# Altium schematic sheet Sheet3.SchDoc
size 420 x 297 mm
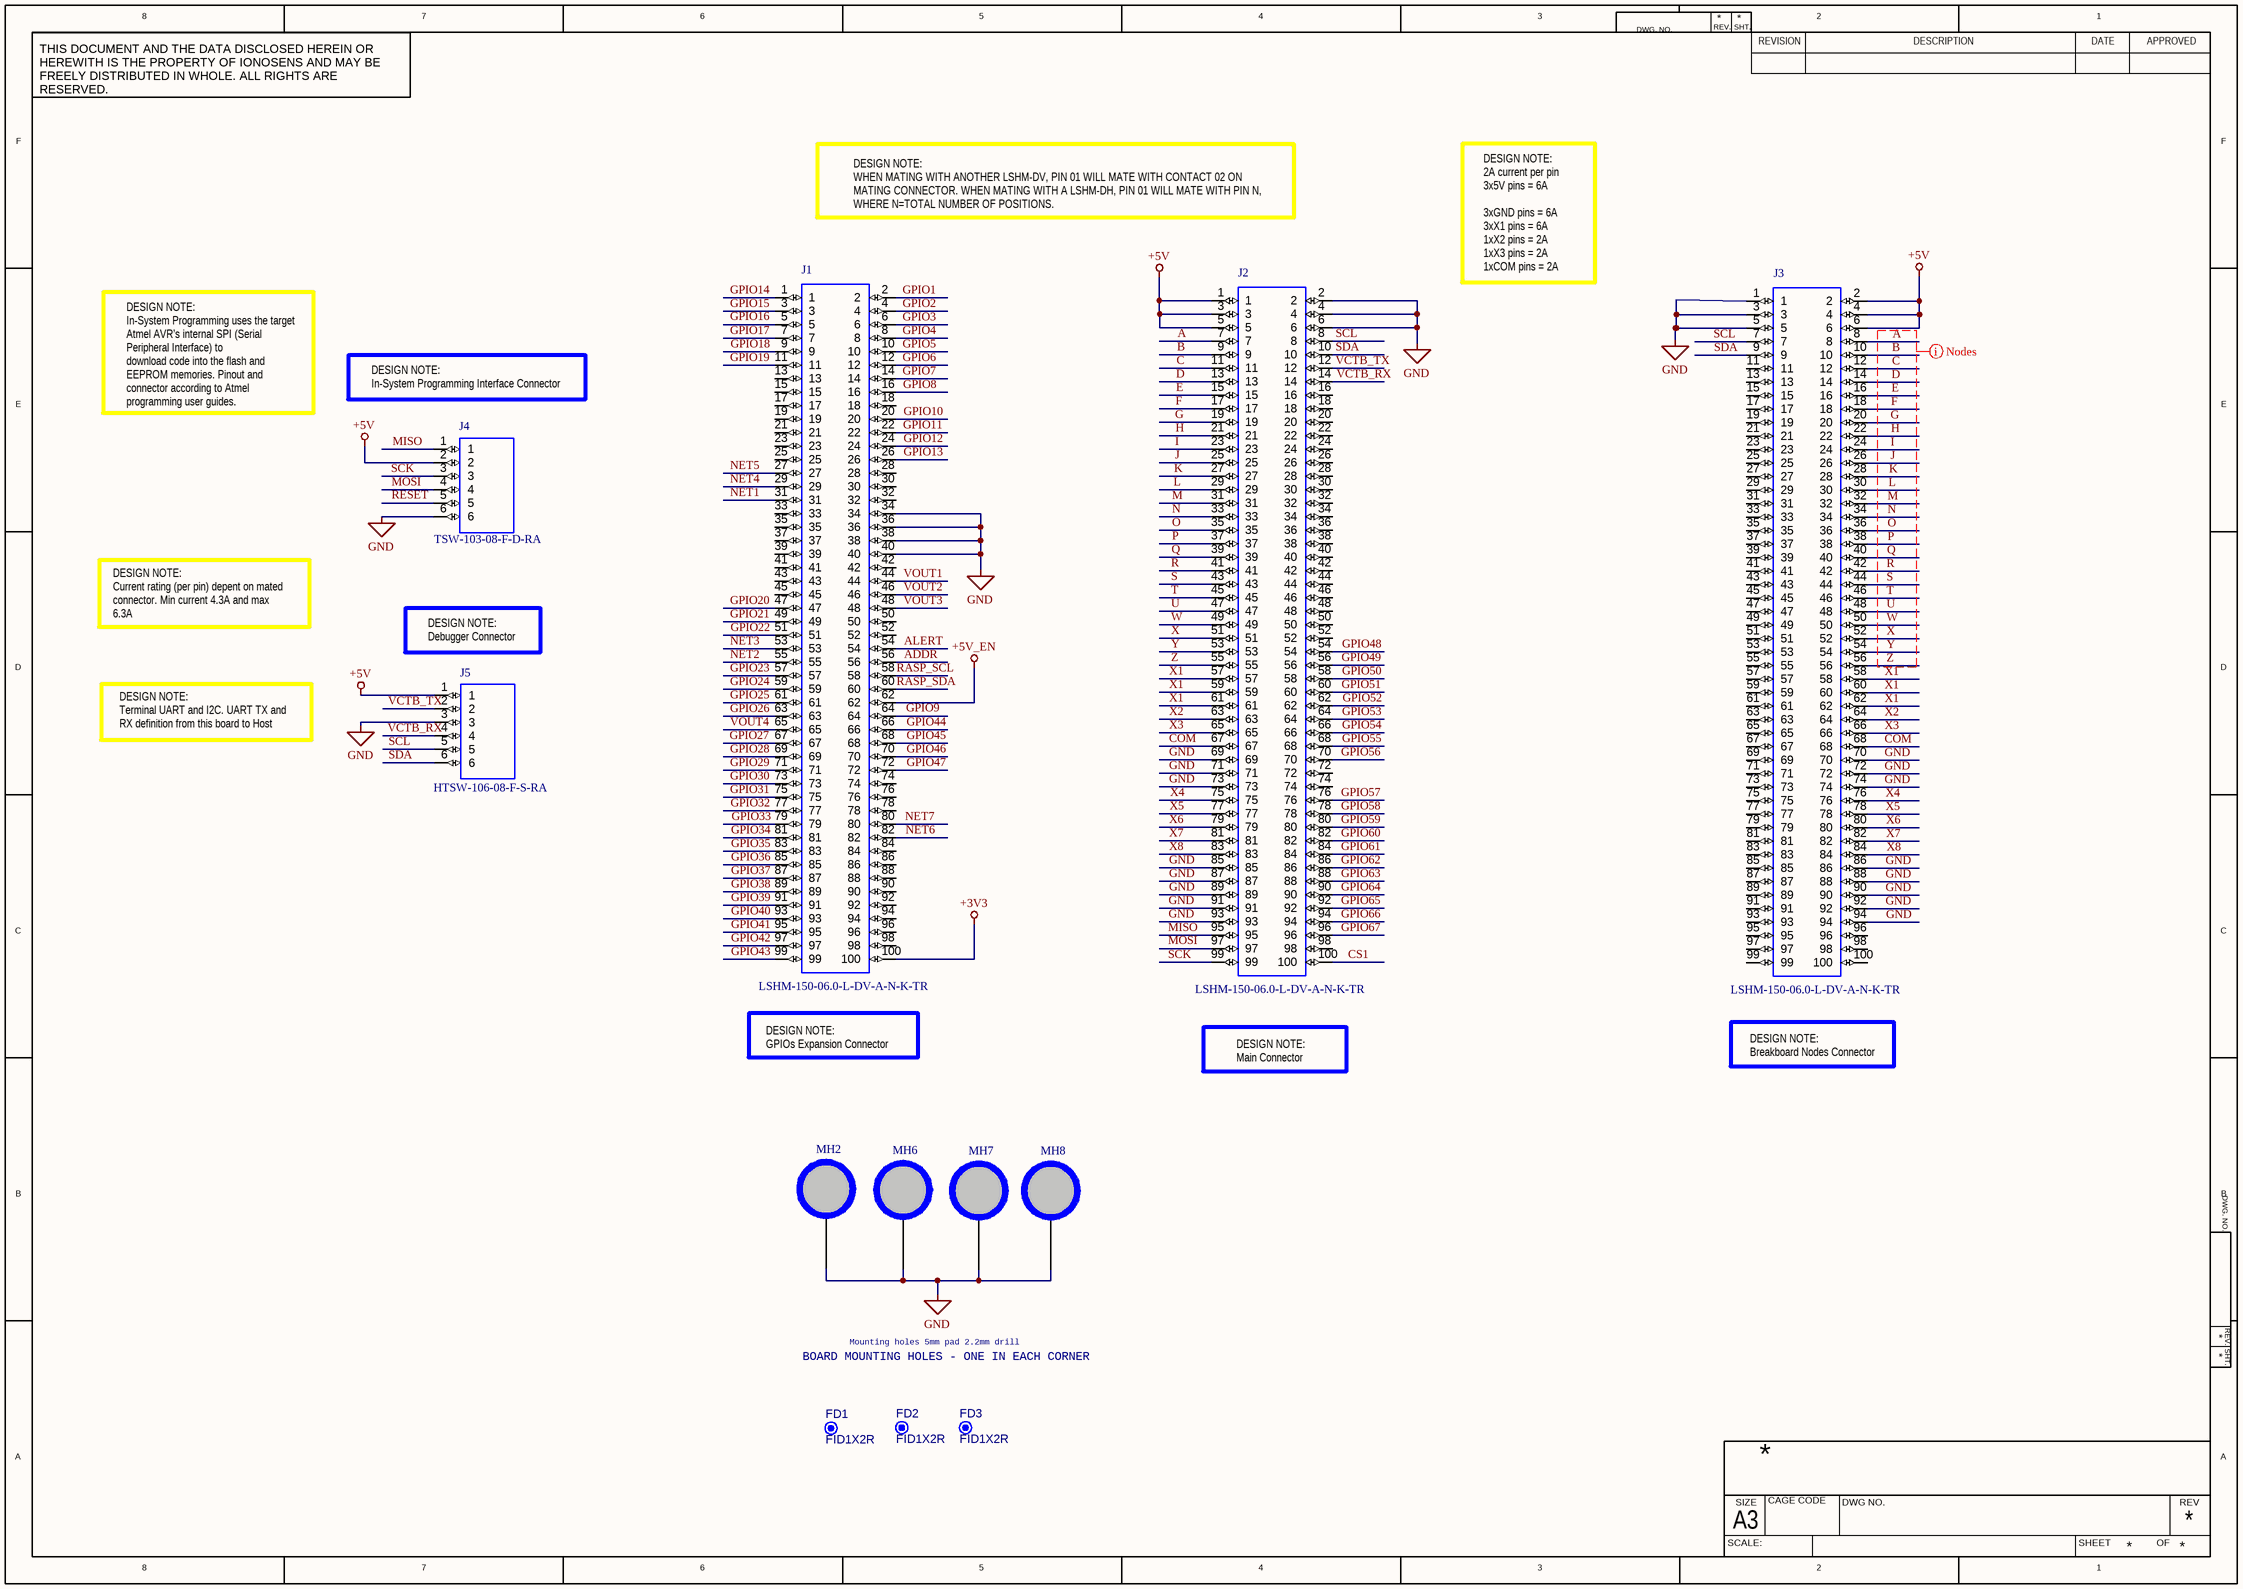
[diagram p0: Sheet3.SchDoc]

## Parts
FD1  FID1X2R  [FID1X2R]  (no BOM)
FD2  FID1X2R  [FID1X2R]  (no BOM)
FD3  FID1X2R  [FID1X2R]  (no BOM)
J1  LSHM-150-06.0-L-DV-A-N-K-TR  [LSHM_150_06_0_L_DV_A_N_K_TR]
J2  LSHM-150-06.0-L-DV-A-N-K-TR  [LSHM_150_06_0_L_DV_A_N_K_TR]
J3  LSHM-150-06.0-L-DV-A-N-K-TR  [LSHM_150_06_0_L_DV_A_N_K_TR]
J4  TSW-103-08-F-D-RA  [TSW-103-08-F-D-RA]
J5  HTSW-106-08-F-S-RA  [TSW-106-08-F-S-RA]
MH2  C500h220  [C500h220z368]  (value not drawn)
MH6  C500h220  [C500h220z368]  (value not drawn)
MH7  C500h220  [C500h220z368]  (value not drawn)
MH8  C500h220  [C500h220z368]  (value not drawn)

## Nets
+3V3: J1.100
+5V: J2.1 J2.3 J2.5 J3.2 J3.4 J3.6 J4.2 J5.1
+5V_EN: J1.62
GND: J1.34 J1.36 J1.38 J1.40 J2.2 J2.4 J2.6 J2.69 J2.71 J2.73 J2.85 J2.87 J2.89 J2.91 J2.93 J3.1 J3.3 J3.5 J3.70 J3.72 J3.74 J3.86 J3.88 J3.90 J3.92 J3.94 J4.6 J5.3 MH2.1 MH6.1 MH7.1 MH8.1
A: J2.7 J3.8
ADDR: J1.56
ALERT: J1.54
B: J2.9 J3.10
C: J2.11 J3.12
COM: J2.67 J3.68
CS1: J2.100
D: J2.13 J3.14
E: J2.15 J3.16
F: J2.17 J3.18
G: J2.19 J3.20
GPIO1: J1.2
GPIO2: J1.4
GPIO3: J1.6
GPIO4: J1.8
GPIO5: J1.10
GPIO6: J1.12
GPIO7: J1.14
GPIO8: J1.16
GPIO9: J1.64
GPIO10: J1.20
GPIO11: J1.22
GPIO12: J1.24
GPIO13: J1.26
GPIO14: J1.1
GPIO15: J1.3
GPIO16: J1.5
GPIO17: J1.7
GPIO18: J1.9
GPIO19: J1.11
GPIO20: J1.47
GPIO21: J1.49
GPIO22: J1.51
GPIO23: J1.57
GPIO24: J1.59
GPIO25: J1.61
GPIO26: J1.63
GPIO27: J1.67
GPIO28: J1.69
GPIO29: J1.71
GPIO30: J1.73
GPIO31: J1.75
GPIO32: J1.77
GPIO33: J1.79
GPIO34: J1.81
GPIO35: J1.83
GPIO36: J1.85
GPIO37: J1.87
GPIO38: J1.89
GPIO39: J1.91
GPIO40: J1.93
GPIO41: J1.95
GPIO42: J1.97
GPIO43: J1.99
GPIO44: J1.66
GPIO45: J1.68
GPIO46: J1.70
GPIO47: J1.72
GPIO48: J2.54
GPIO49: J2.56
GPIO50: J2.58
GPIO51: J2.60
GPIO52: J2.62
GPIO53: J2.64
GPIO54: J2.66
GPIO55: J2.68
GPIO56: J2.70
GPIO57: J2.76
GPIO58: J2.78
GPIO59: J2.80
GPIO60: J2.82
GPIO61: J2.84
GPIO62: J2.86
GPIO63: J2.88
GPIO64: J2.90
GPIO65: J2.92
GPIO66: J2.94
GPIO67: J2.96
H: J2.21 J3.22
I: J2.23 J3.24
J: J2.25 J3.26
K: J2.27 J3.28
L: J2.29 J3.30
M: J2.31 J3.32
MISO: J2.95 J4.1
MOSI: J2.97 J4.4
N: J2.33 J3.34
NET1: J1.31
NET2: J1.55
NET3: J1.53
NET4: J1.29
NET5: J1.27
NET6: J1.82
NET7: J1.80
O: J2.35 J3.36
P: J2.37 J3.38
Q: J2.39 J3.40
R: J2.41 J3.42
RASP_SCL: J1.58
RASP_SDA: J1.60
RESET: J4.5
S: J2.43 J3.44
SCK: J2.99 J4.3
SCL: J2.8 J3.7 J5.5
SDA: J2.10 J3.9 J5.6
T: J2.45 J3.46
U: J2.47 J3.48
VCTB_RX: J2.14 J5.4
VCTB_TX: J2.12 J5.2
VOUT1: J1.44
VOUT2: J1.46
VOUT3: J1.48
VOUT4: J1.65
W: J2.49 J3.50
X: J2.51 J3.52
X1: J2.57 J2.59 J2.61 J3.58 J3.60 J3.62
X2: J2.63 J3.64
X3: J2.65 J3.66
X4: J2.75 J3.76
X5: J2.77 J3.78
X6: J2.79 J3.80
X7: J2.81 J3.82
X8: J2.83 J3.84
Y: J2.53 J3.54
Z: J2.55 J3.56

Not connected (* = marked no-connect by the designer): J1 13 15 17 18 19 21 23 25 28 30 32 33 35 37 39 41 42 43 45 50 52 74 76 78 84 86 88 90 92 94 96 98; J2 16 18 20 22 24 26 28 30 32 34 36 38 40 42 44 46 48 50 52 72 74 98; J3 11 13 15 17 19 21 23 25 27 29 31 33 35 37 39 41 43 45 47 49 51 53 55 57 59 61 63 65 67 69 71 73 75 77 79 81 83 85 87 89 91 93 95 96 97 98 99 100

## Layout directives
net class Nodes: A, B, C, D, E, F, G, H, I, J, K, L, M, N, O, P, Q, R, S, T, U, W, X, Y, Z

## Notes on the sheet
- DESIGN NOTE:
  WHEN MATING WITH ANOTHER LSHM-DV, PIN 01 WILL MATE WITH CONTACT 02 ON
  MATING CONNECTOR. WHEN MATING WITH A LSHM-DH, PIN 01 WILL MATE WITH PIN N,
  WHERE N=TOTAL NUMBER OF POSITIONS.
- DESIGN NOTE:
  2A current per pin
  3x5V pins = 6A
  3xGND pins = 6A
  3xX1 pins = 6A
  1xX2 pins = 2A
  1xX3 pins = 2A
  1xCOM pins = 2A
- DESIGN NOTE:
  In-System Programming Interface Connector
- DESIGN NOTE:
  In-System Programming uses the target Atmel AVR’s internal SPI (Serial Peripheral Interface) to
  download code into the flash and EEPROM memories. Pinout and connector according to Atmel programming user guides.
- DESIGN NOTE:
  Current rating (per pin) depent on mated connector. Min current 4.3A and max 6.3A
- (near J5) DESIGN NOTE:
  Debugger Connector
- DESIGN NOTE:
  Terminal UART and I2C. UART TX and RX definition from this board to Host
- DESIGN NOTE:
  GPIOs Expansion Connector
- DESIGN NOTE:
  Main Connector
- DESIGN NOTE:
  Breakboard Nodes Connector
- BOARD MOUNTING HOLES - ONE IN EACH CORNER
- Mounting holes 5mm pad 2.2mm drill
- 8
- 7
- 6
- 5
- 4
- 3
- DWG. NO.
- REV.
- SHT.
- REVISION
- 2
- DESCRIPTION
- DATE
- 1
- APPROVED
- THIS DOCUMENT AND THE DATA DISCLOSED HEREIN OR HEREWITH IS THE PROPERTY OF IONOSENS AND MAY BE FREELY DISTRIBUTED IN WHOLE. ALL RIGHTS ARE RESERVED.
- F
- E
- D
- C
- B
- A
- SCALE:
- A3
- SIZE
- CAGE CODE
- DWG NO.
- SHEET
- OF
- REV

## Library data of the parts
FD1-FD3 = CMP-00028-00005-2: Fiducial - Round 1x2mm; Pins: 0
J1-J3 = J01-001-01-00001-2: Conn Socket and Terminal Strip HDR/SKT 100 POS 0.5mm Solder ST SMD T/R; Manufacturer: Samtec; Gender: HERMAPHRODITIC; Pitch: 500 µm; Contact Plating: Gold; Case/Package: SMD; Max Operating Temperature: 125°C; Number of Rows: 2; RoHS Compliant: Yes; Housing Color: Black; Mounting Technology: SMD; Pins: 100; Termination: Solder; Orientation: Straight; Depth: 4.98 mm; Length: 29.7 mm; Contact Material: Bronze; Housing Material: Polymer; Min Operating Temperature: -55°C; Manufacturer P/N: LSHM-150-06.0-L-DV-A-N-K-TR
J4 = J01-001-01-00003-2: 6 Vias Pin Header 2.54mm, Right Angle; Manufacturer: Samtec; Gender: Male; RoHS Compliant: Yes; Min Operating Temperature: -55°C; Case/Package: Through Hole; Termination: Solder; Depth: 4.87 mm; Max Operating Temperature: 125°C; Housing Material: Polyester; Mounting Technology: Through Hole; Number of Rows: 2; Pitch: 2.54mm; Contact Plating: Gold; Contact Material: Bronze; Manufacturer P/N: TSW-103-08-F-D-RA; Pins: 6; Orientation: Straight; Length: 7.62 mm; Housing Color: Black
J5 = J01-001-01-00005-2: 6 Vias Pin Header 2.54mm, Right Angle, 1 Row; Manufacturer: Samtec; Gender: Male; Manufacturer P/N: HTSW-106-08-F-S-RA; Contact Plating: Gold; Length: 7.62 mm; Pins: 6; Housing Material: Polyester; Housing Color: Black; RoHS Compliant: Yes; Case/Package: Through Hole; Pitch: 2.54mm; Mounting Technology: Through Hole; Depth: 4.87 mm; Orientation: Straight; Number of Rows: 2; Contact Material: Bronze; Max Operating Temperature: 125°C; Min Operating Temperature: -55°C; Termination: Solder
MH2 MH6-MH8 = CMP-00028-00007-2: hole 5mm pad drill 2.2; Manufacturer: Ionosens; Manufacturer P/N: H5D22; Mounting Technology: Pad; RoHS Compliant: yes; Case/Package: Pad; Min Operating Temperature: 125°C; Pins: 1; Max Operating Temperature: -40°C